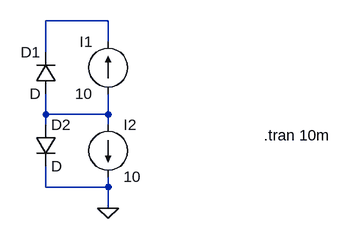
[diagram p0: schematic Draft3.asc]
Draft3.asc, the LTspice schematic file:
Version 4
SHEET 1 880 680
WIRE 512 -160 416 -160
WIRE 512 -128 512 -160
WIRE 416 -112 416 -160
WIRE 416 -16 416 -48
WIRE 512 -16 512 -48
WIRE 512 -16 416 -16
WIRE 416 0 416 -16
WIRE 512 0 512 -16
WIRE 416 96 416 64
WIRE 512 96 512 80
WIRE 512 96 416 96
WIRE 512 128 512 96
FLAG 512 128 0
SYMBOL current 512 -48 R180
WINDOW 0 24 80 Left 2
WINDOW 3 24 0 Left 2
WINDOW 123 0 0 Left 0
WINDOW 39 0 0 Left 0
SYMATTR InstName I1
SYMATTR Value 10
SYMBOL current 512 0 R0
WINDOW 123 0 0 Left 0
WINDOW 39 0 0 Left 0
SYMATTR InstName I2
SYMATTR Value 10
SYMBOL diode 432 -48 R180
WINDOW 0 24 64 Left 2
WINDOW 3 24 0 Left 2
SYMATTR InstName D1
SYMBOL diode 400 0 R0
SYMATTR InstName D2
TEXT 752 16 Left 2 !.tran 10m

The netlist it stands for:
* Draft3.asc
I1 N002 N001 10
I2 N002 0 10
D1 N002 N001 D
D2 N002 0 D
.model D D
.lib standard.dio
.tran 10m
.backanno
.end